# EAGLE design schematic (EAGLE 6.3)
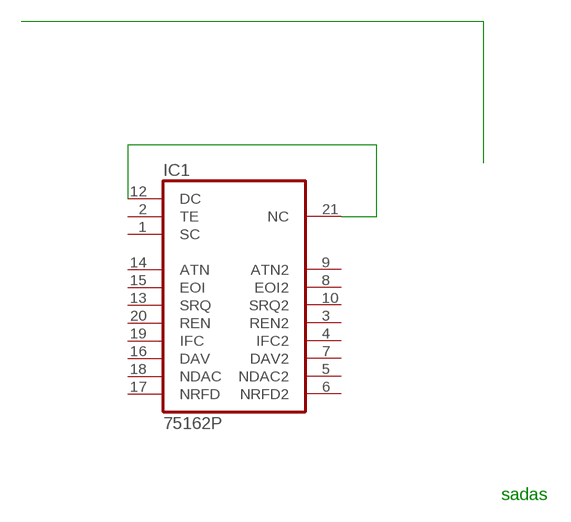
[diagram p0: schematic, sheet 1]

## Parts
IC1  75162P  [DIL22-3]

## Nets
N$2: IC1.12(DC) IC1.21(NC)
Unconnected: IC1.1(SC) IC1.2(TE) IC1.3(REN2) IC1.4(IFC2) IC1.5(NDAC2) IC1.6(NRFD2) IC1.7(DAV2) IC1.8(EOI2) IC1.9(ATN2) IC1.10(SRQ2) IC1.13(SRQ) IC1.14(ATN) IC1.15(EOI) IC1.16(DAV) IC1.17(NRFD) IC1.18(NDAC) IC1.19(IFC) IC1.20(REN)

## Notes on the sheet
- sadas

## Power pins joined to a net without a drawn wire
GND: IC1.11(GND)
VCC: IC1.22(VCC)

## Library data of the parts
IC1 = 751xx:75162: 75xxx DEVICE

## Board
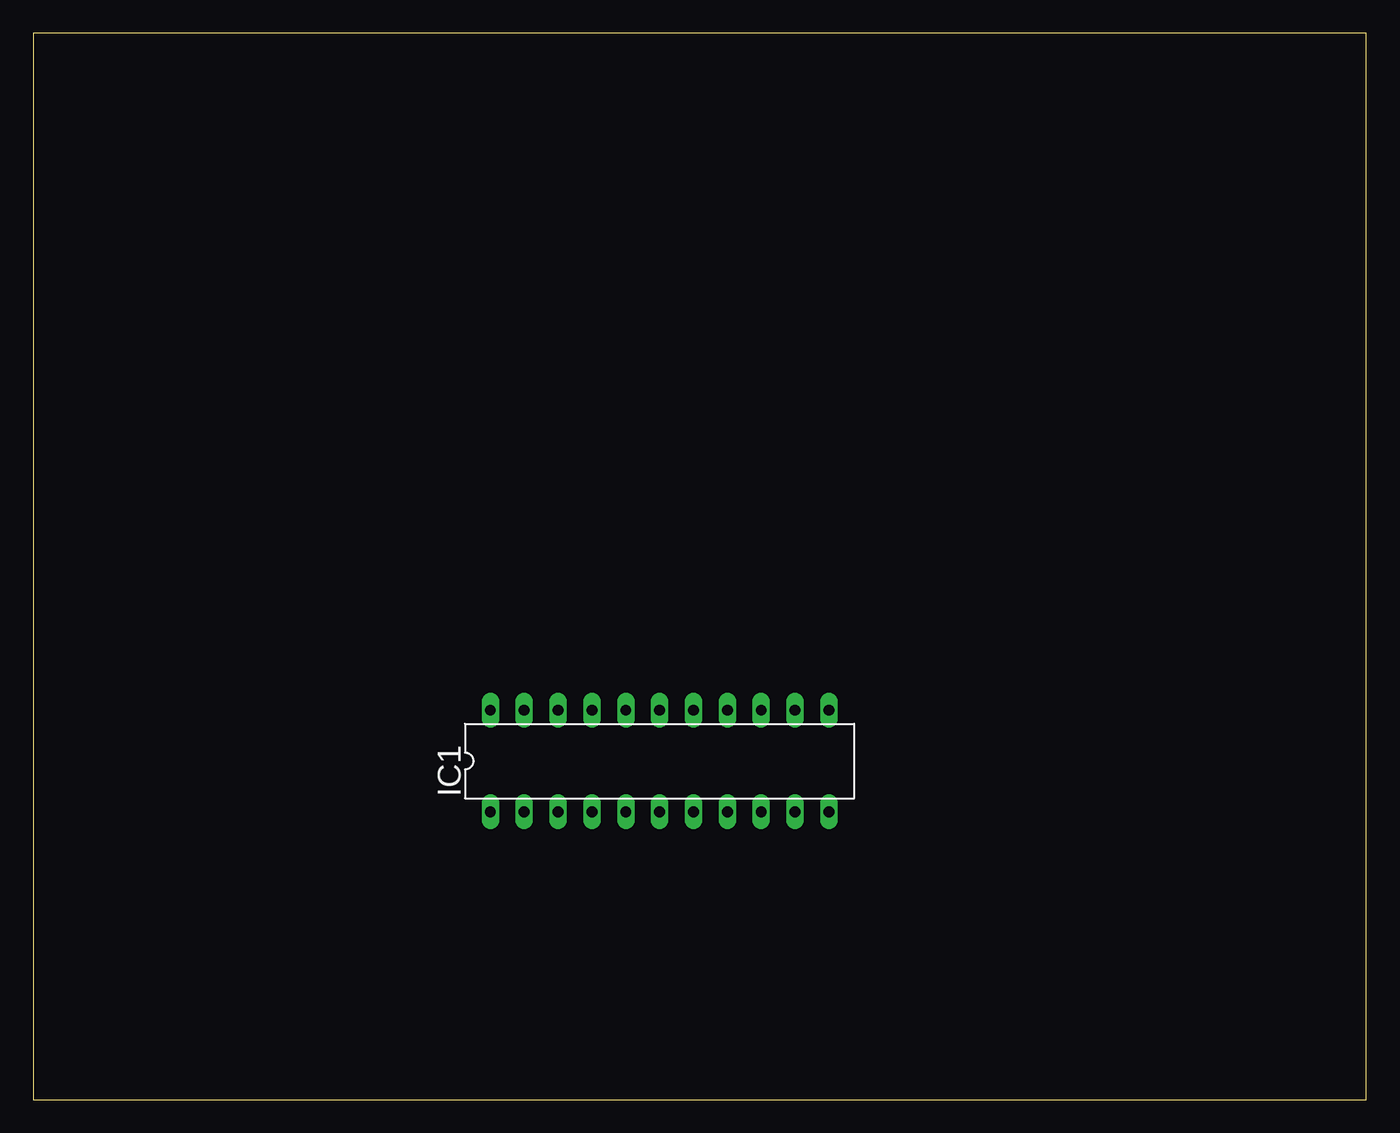
[diagram p1: board, top side]
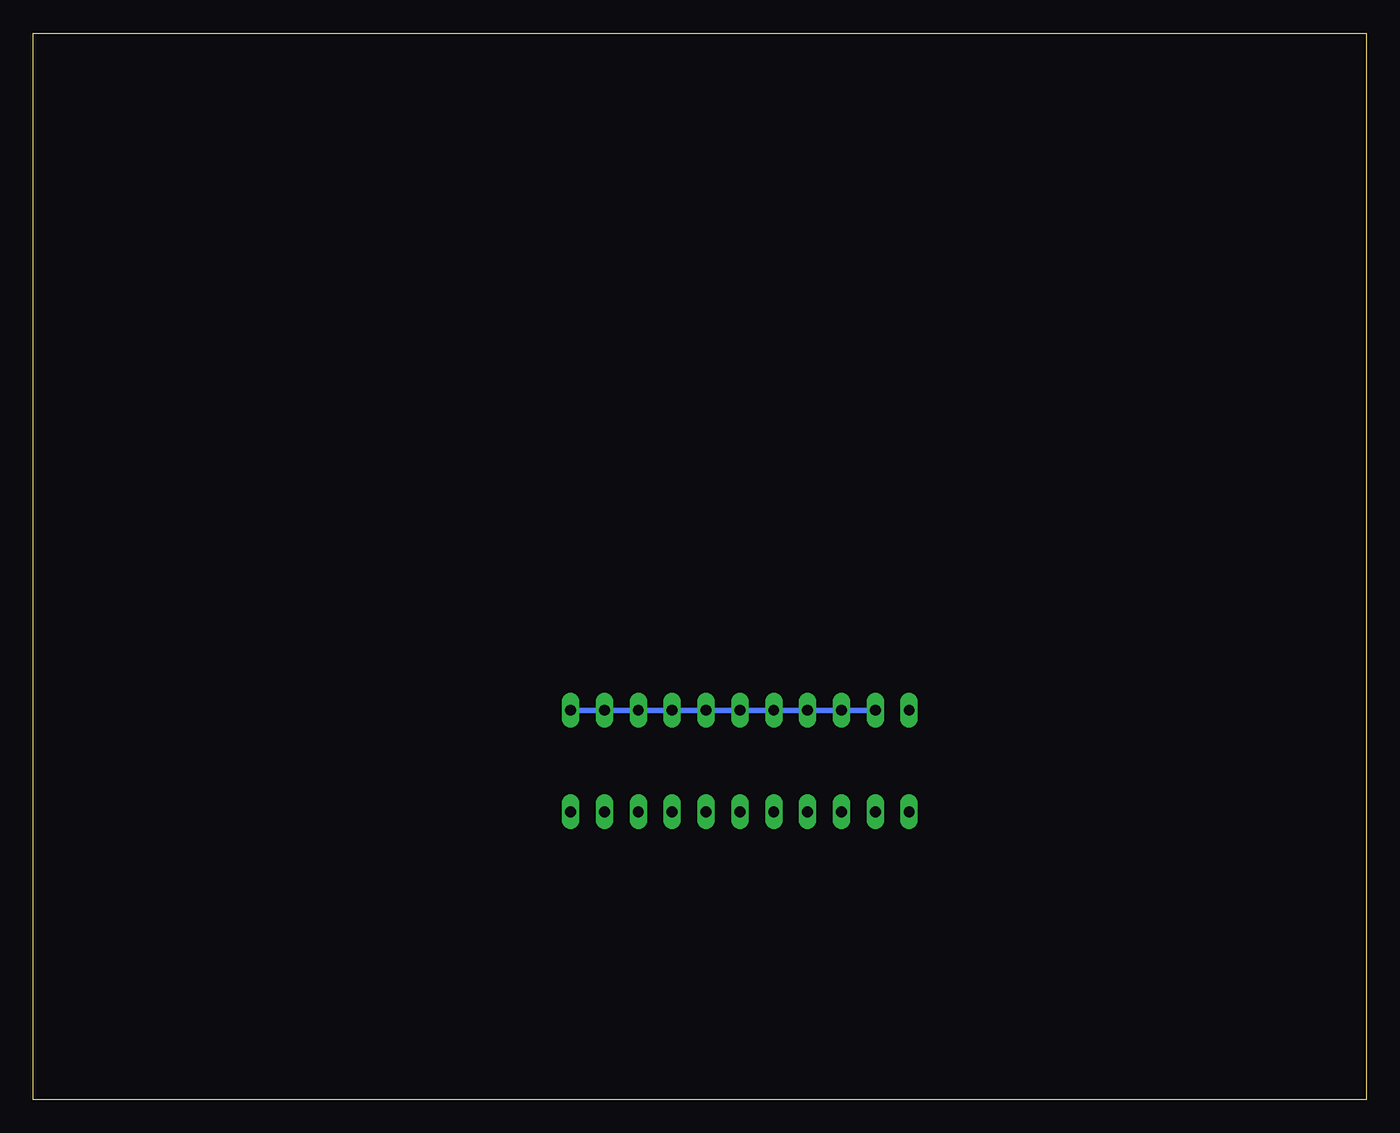
[diagram p2: board, bottom side, seen from below]

Size 100 x 80 mm. Coordinates in mm from the lower left corner, seen from the top.
Outline: 0,0 100,0 100,80 0,80 0,0
Copper layers (1*16): Top 0.035mm / dielectric 1.5mm / Bottom 0.035mm
Design rules "default": minimum track width 10mil, minimum drill 24mil, track to track 8mil, track to pad 8mil, pad to pad 8mil, via to via 8mil, smd to smd 8mil, copper to edge 40mil, drill to drill 8mil, minimum pad ring 10mil, minimum via ring 8mil, stop-mask expansion 4mil, vias tented up to drill 0mil, thermal gap 10mil

### Footprints (pad centres in the part's own frame; a part is rotated, then mirrored left to right if it is on the bottom)
DIL22-3 = drill 0.813 long: 1 -12.7,-3.81; 2 -10.16,-3.81; 3 -7.62,-3.81; 4 -5.08,-3.81; 5 -2.54,-3.81; 6 0,-3.81; 7 2.54,-3.81; 8 5.08,-3.81; 9 7.62,-3.81; 10 10.16,-3.81; 11 12.7,-3.81; 12 12.7,3.81; 13 10.16,3.81; 14 7.62,3.81; 15 5.08,3.81; 16 2.54,3.81; 17 0,3.81; 18 -2.54,3.81; 19 -5.08,3.81; 20 -7.62,3.81; 21 -10.16,3.81; 22 -12.7,3.81

### Placement (x,y rotation side)
IC1  46.99,25.4 0 top

### Tracks (layer width: path | path; a pad name or v marks a point on that pad's centre or on a via)
N$2
  Bottom 0.406: IC1.21 IC1.12